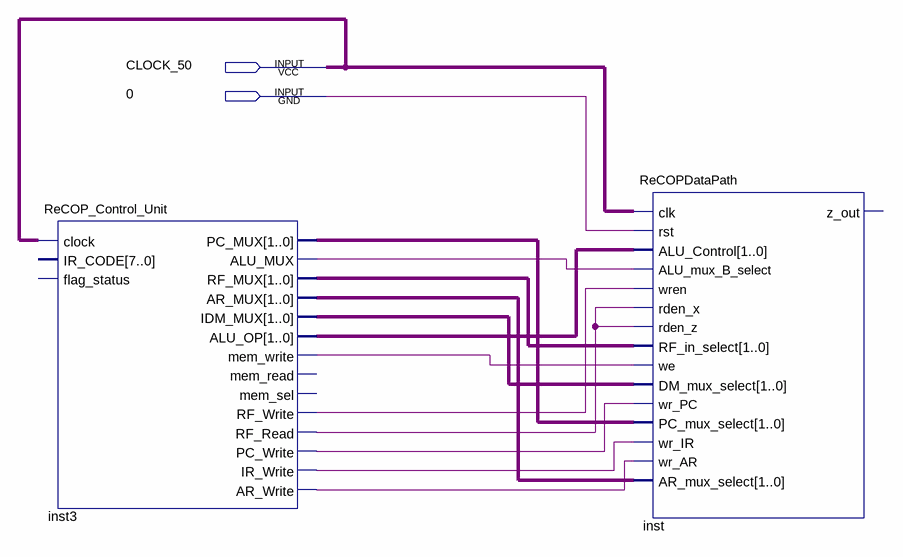
[diagram p0: schematic sheet]
// Quartus schematic time_critical_system.bdf as structural Verilog: 2 symbols, 2 pins
module time_critical_system (
  input  CLOCK_50,
  input  \0 
);

  wire inst3_alu_mux, inst3_ar_write, inst3_ir_write, inst3_mem_write, inst3_pc_write, inst3_rf_read,
       inst3_rf_write;
  wire [1:0] inst3_alu_op, inst3_ar_mux, inst3_idm_mux, inst3_pc_mux, inst3_rf_mux;

  ReCOP_Control_Unit inst3 (
    .clock(CLOCK_50), .PC_MUX(inst3_pc_mux), .ALU_MUX(inst3_alu_mux), .RF_MUX(inst3_rf_mux),
    .AR_MUX(inst3_ar_mux), .IDM_MUX(inst3_idm_mux), .ALU_OP(inst3_alu_op), .mem_write(inst3_mem_write),
    .RF_Write(inst3_rf_write), .RF_Read(inst3_rf_read), .PC_Write(inst3_pc_write), .IR_Write(inst3_ir_write),
    .AR_Write(inst3_ar_write));  // open: IR_CODE, flag_status, mem_read, mem_sel
  ReCOPDataPath inst (
    .clk(CLOCK_50), .rst(\0 ), .ALU_Control(inst3_alu_op), .ALU_mux_B_select(inst3_alu_mux),
    .wren(inst3_rf_write), .rden_x(inst3_rf_read), .rden_z(inst3_rf_read), .RF_in_select(inst3_rf_mux),
    .we(inst3_mem_write), .DM_mux_select(inst3_idm_mux), .wr_PC(inst3_pc_write),
    .PC_mux_select(inst3_pc_mux), .wr_IR(inst3_ir_write), .wr_AR(inst3_ar_write), .AR_mux_select(inst3_ar_mux));  // open: z_out
endmodule
